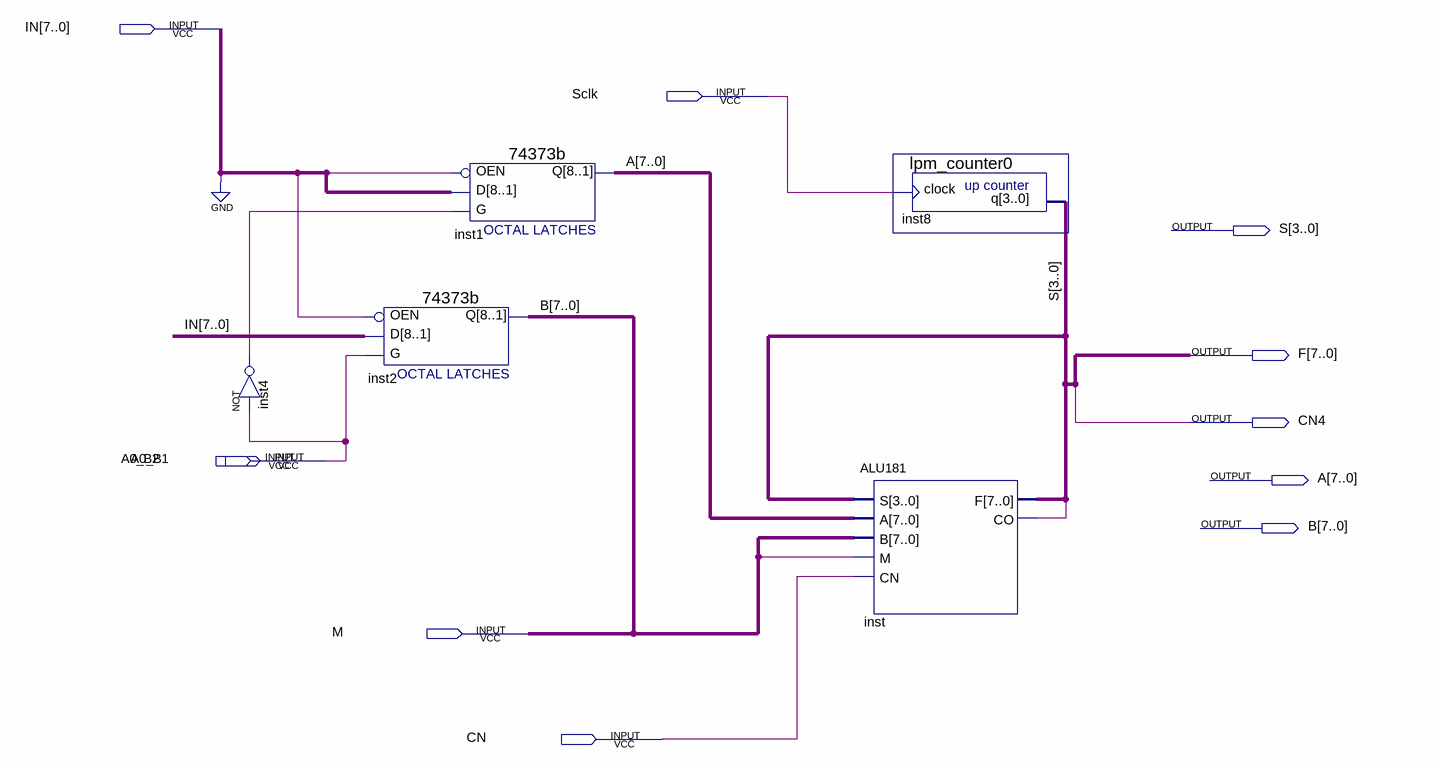
[diagram p0: schematic sheet]
// Quartus schematic alu.bdf as structural Verilog: 5 symbols, 11 pins
module alu (
  input  [7:0] IN,
  input  Sclk,
  input  A0_B2,
  input  A0_B1,
  input  M,
  input  CN,
  output [3:0] S,
  output [7:0] F,
  output CN4,
  output [7:0] A,
  output [7:0] B
);

  wire inst4_out, inst_co, undriven, undriven_2, undriven_3;

  not inst4 (inst4_out, A0_B1);
  \74373b  inst2 (.D(IN), .G(A0_B1), .OEN(undriven), .Q(B));
  \74373b  inst1 (.D(IN), .G(inst4_out), .OEN(undriven_3), .Q(A));
  ALU181 inst (.S(F), .A(A), .B(B), .M(undriven_2), .CN(CN), .F(F), .CO(inst_co));
  lpm_counter0 inst8 (.clock(Sclk), .q(S));
endmodule
